# Altium schematic sheet PowerConversion12-5.SchDoc
size A4; SheetNumber: 1; SheetTotal: 5
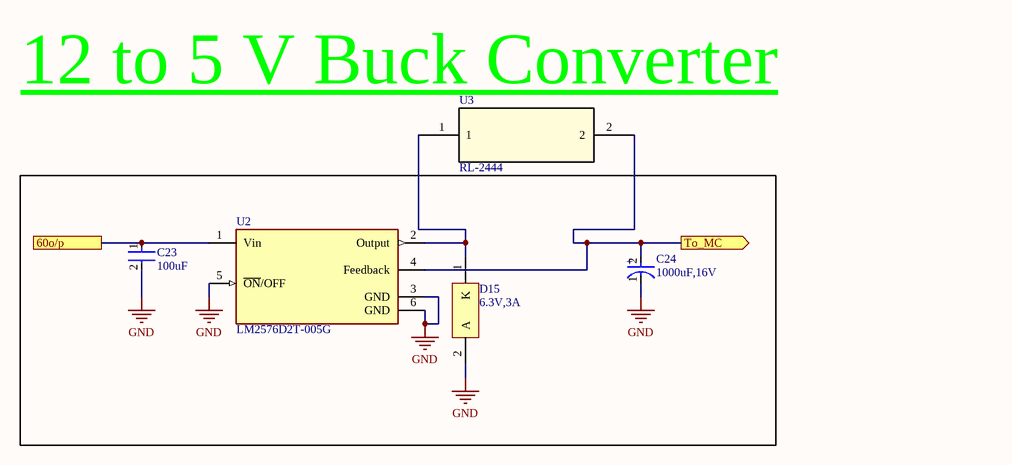
[diagram p0: PowerConversion12-5.SchDoc]

## Parts
C23  100uF  [FP-GRM32-0_3-MFG]
C24  1000uF,16V  [FP-FTG-MFG]
D15  6.3V,3A  [ONSC-AXIAL_LEAD-2-267-05_V]
U2  LM2576D2T-005G  [FP-936A-02-MFG]
U3  RL-2444  [TO_2444_RCE]

## Ports
60o/p, To_MC (out)

## Nets
GND: C23.2 C24.1(C) D15.2(A) U2.3(GND) U2.5(~{ON}/OFF) U2.6(GND)
60o/p: C23.1 U2.1(Vin) ; port 60o/p
To_MC: C24.2(A) U2.4(Feedback) U3.2 ; port To_MC
NetD15_1: D15.1(K) U2.2(Output) U3.1

## Notes on the sheet
- (near U3) 12 to 5 V Buck Converter <https://www.ti.com/lit/ds/symlink/lm2576.pdf?ts=1719141097345&ref_url=https%253A%252F%252Fwww.ti.com%252Fproduct%252FLM2576%253Fbm-verify%253DAAQAAAAJ_____20xXorgmd3L2iiyA7YaYY-B0ytZ6Vm8qRpIuBXxtlcEPupYVp6ockKfNIyFnG12vUB6imkmU6VMgzrirQYNBWE5fVMLX9fwT3A02H60yYkUd-NfVZ8KDAzB334s8esmg7cQcQ1K5TPytDwWpsyIElFQe-g2pUepeuzVCNX4GbQoAi_Gt0HKMlqRWV59FVizy6oJZh3A45QZ2yxrvDCUG82br5dt7YP5Uh4XVJG4Q0NPKkruNYcOEC634qwUvbYoaNreYSjoatr_JT-d4Fee9oXSp8p2rqE3PoxFg52oKUpOodk>
- (in symbol CMP-05427-000086-1) +

## Library data of the parts
C23 = CMP-2000-05259-2: CAP CER 100UF 6.3V X5R 1210; 3DS Part Number: 220-00002; Manufacturer Part Number: GRM32ER60J107ME20L; Manufacturer: Murata; Temperature Coefficient: 15%; Material: Ceramic; Tolerance: 20%; Octopart: https://octopart.com/grm32er60j107me20l-murata-197007; ComponentLink2URL: https://search.murata.co.jp/Ceramy/image/img/A01X/G101/ENG/GRM32ER60J107ME20-01.pdf; Temperature Range High: +85°C; RoHS: TRUE; Device Class L3: Ceramic Capacitors; Device Class L2: Capacitors; Voltage: 6.3V; Package: GRM32-0.3; Voltage Rating: 6.3V; Category: Cap; Device Class L1: Passive Components; Temperature Characteristic: X5R; Automotive: No; Digikey Description: CAP CER 100UF 6.3V X5R 1210; Temperature: -55°C to +85°C; Height: 2.7mm; Ipc Land Pattern Name: CAPC320250X250; Capacitance: 100uF; Temperature Range Low: -55°C; Lead Free: Yes; Value: 100uF; ComponentLink2Description: Datasheet
C24 = CMP-05427-000086-1: CAP ALUM 1000UF 20% 16V SMD; Life (Hours): 2000Hour; Ripple Current: 1.19A; Capacitance: 1mF; ESR (Equivalent Series Resistance): 60mR; Leakage Current: 160uA; Lead Diameter: 0.9mm; Height: 10.2mm; Radiation Hardening: No; Tolerance: 20%; Lead Free: Lead Free; Construction: Cylindrical; Voltage Rating (DC): 16V; Package Quantity: 1; REACH SVHC: No SVHC; Series: FT; Packaging: Tape and Reel; RoHS Compliant: Yes; Lead Pitch: 4.6mm; Diameter: 10mm; Voltage Rating: 16V; Height - Seated (Max): 0.413inch; Length: 10.2mm; Voltage: 16V; Max Operating Temperature: 105°C; Ripple Current (AC): 1.19A; Min Operating Temperature: -55°C; Termination: SMD/SMT; Mount: Surface Mount; Case/Package: Radial
D15 = CMP-1055-00027-1: Rectifier, 2-Pin Axial_Lead, Pb-Free, Tape and Reel; PartNumber: 1N5820RLG; Manufacturer: On Semiconductor; Configuration: Single; IFSM Max (A): 80; ComponentLink3Description: Package Specification; PackageReference: AXIAL_LEAD-2-267-05; Mounting Technology: Through Hole; ComponentLink3URL: http://www.onsemi.com/pub_link/Collateral/267-05.PDF; ComponentLink2Description: Datasheet; ComponentLink1URL: http://www.onsemi.com/; PackageVersion: Rev. G, 06/2000; Packing: Tape and Reel; DatasheetVersion: Rev. 10; RoHS: TRUE; ComponentLink2URL: http://www.onsemi.cn/pub_link/Collateral/1N5820-D.PDF; ComponentLink1Description: Manufacturer URL; PackageDescription: 2-Pin, Axial Lead, Diameter 5.05 mm
U2 = CMP-07129-000010-1: IC REG MULTI CONFG 5V 3A D2PAK-5; Manufacturer: ON Semiconductor; Standoff Height: 0mm; Max Junction Temp: +125°C; Output Type: Fixed; Switching Frequency: 52kHz; Switching Topology: Buck; Number Of Outputs: 1; Nominal Supply Current: 5mA; Max Supply Voltage: 40V; Max Duty Cycle: 98%; Min Supply Voltage: 7V; Category: IC; Device Class L2: Power Management ICs; Footprint Url: https://www.onsemi.com/pub/Collateral/936A-02.PDF; Temperature: -40°C to +125°C; Device Class L3: Voltage Regulators - Switching; Height: 4.826mm; Lead Free: Yes; Manufacturer Part Number: LM2576D2T-005G; Automotive: No; Temperature Range Low: -40°C; RoHS: TRUE; Digikey Description: IC REG MULTI CONFG 5V 3A D2PAK-5; Package: 936A-02; Octopart: https://octopart.com/lm2576d2t-005g-on+semiconductor-725168; Device Class L1: Integrated Circuits (ICs); Temperature Range High: +125°C; Mouser Description: Buck Regulator, Switching, 3.0 A, 15 V 3.0 A, 5.0 V, 52 kHz; Output Voltage: 5V; ComponentLink2URL: https://www.onsemi.cn/PowerSolutions/document/LM2576-D.PDF; ComponentLink2Description: Datasheet; Output Current: 3A
U3 = RL-2444: No Description Available; Mfr_Name: Renco Electronics; RefDes: RefDes; Type: Type